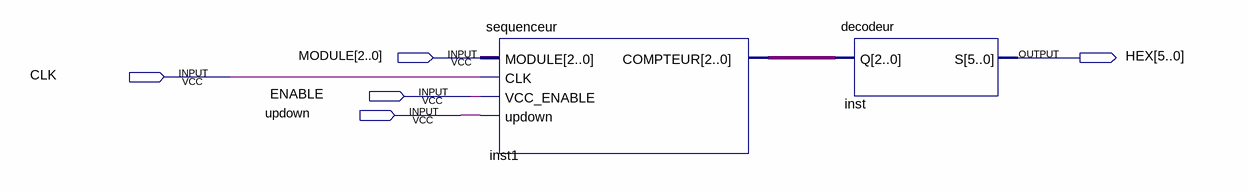
[diagram p0: schematic sheet]
// Quartus schematic sequenceurComplet.bdf as structural Verilog: 2 symbols, 5 pins
module sequenceurComplet (
  input  [2:0] MODULE,
  input  CLK,
  input  ENABLE,
  input  updown,
  output [5:0] HEX
);

  wire [2:0] inst1_compteur;

  sequenceur inst1 (.MODULE(MODULE), .CLK(CLK), .VCC_ENABLE(ENABLE), .updown(updown), .COMPTEUR(inst1_compteur));
  decodeur inst (.Q(inst1_compteur), .S(HEX));
endmodule
